# EAGLE design DMGC-PWR-01_2-0 (EAGLE 9.6.2)
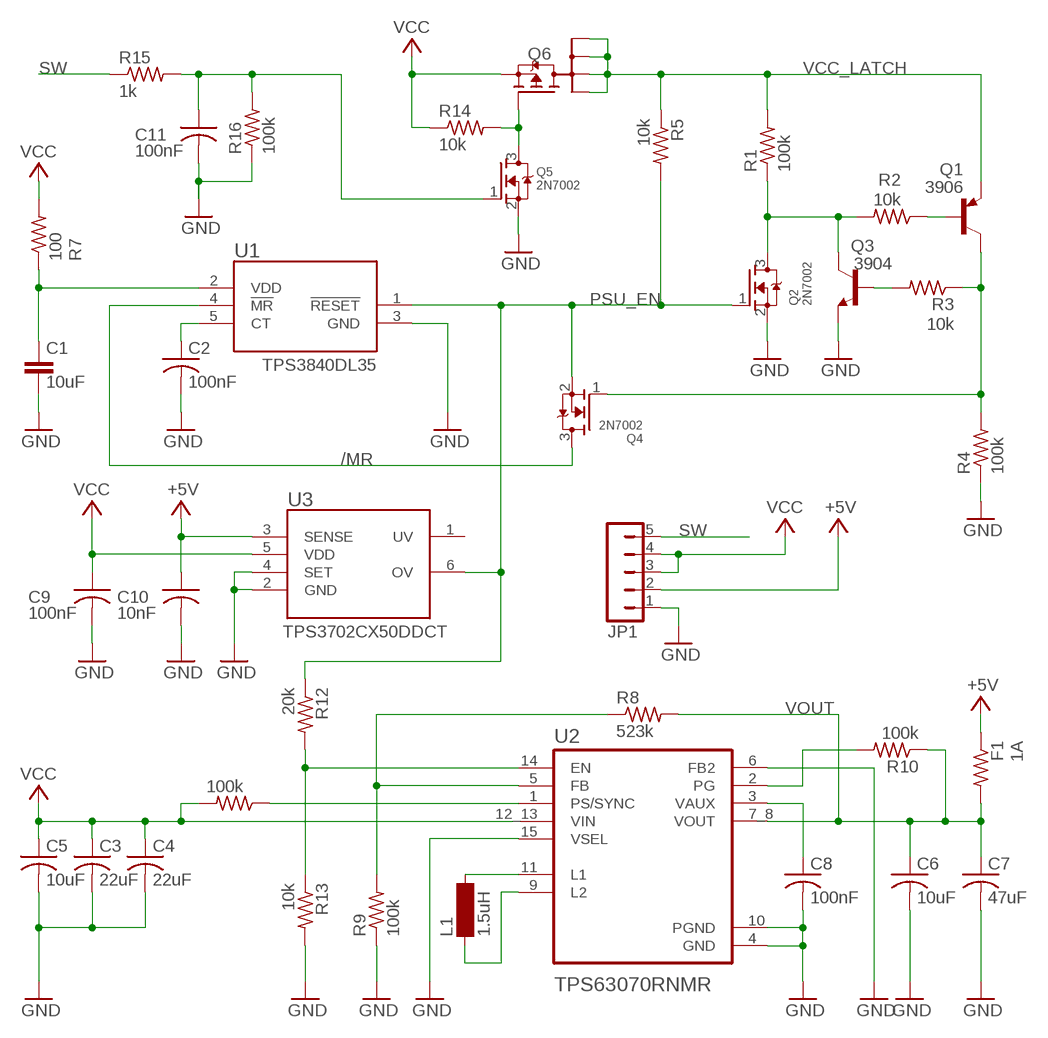
[diagram p0: schematic, sheet 1]

## Parts
C1  10uF  C-EUC0603  [C0603]
C2  100nF  C-USC0603  [C0603]
C3  22uF  C-USC1206  [C1206]
C4  22uF  C-USC1206  [C1206]
C5  10uF  C-USC0603  [C0603]
C6  10uF  C-USC0603  [C0603]
C7  47uF  C-USC1206  [C1206]
C8  100nF  C-USC0603  [C0603]
C9  100nF  C-USC0603  [C0603]
C10  10nF  C-USC0603  [C0603]
C11  100nF  C-USC0603  [C0603]
F1  1A  R-US_R0603  [R0603]
JP1  JP5  [JP5]
L1  1.5uH  LQH3NPN2R2  [1212]
Q1  MMBT3906LT1SMD  [SOT23-BEC]
Q2  2N7002  MOSFET-NREFLOW  [SOT23]
Q3  3904  MMBT3904LT1-NPN-SOT23-BEC  [SOT23-BEC]
Q4  2N7002  MOSFET-NREFLOW  [SOT23]
Q5  2N7002  MOSFET-NREFLOW  [SOT23]
Q6  SI1401EDH  [SOT363_INFINEON]
R1  100k  R-US_R0603  [R0603]
R2  10k  R-US_R0603  [R0603]
R3  10k  R-US_R0603  [R0603]
R4  100k  R-US_R0603  [R0603]
R5  10k  R-US_R0603  [R0603]
R7  100  R-US_R0603  [R0603]
R8  523k  R-US_R0603  [R0603]
R9  100k  R-US_R0603  [R0603]
R10  100k  R-US_R0603  [R0603]
R11  100k  R-US_R0603  [R0603]
R12  20k  R-US_R0603  [R0603]
R13  10k  R-US_R0603  [R0603]
R14  10k  R-US_R0603  [R0603]
R15  1k  R-US_R0603  [R0603]
R16  100k  R-US_R0603  [R0603]
U1  TPS3840  [SOT-23-5]
U2  TPS63070RNMR  [VREG_TPS63070RNMR]
U3  TPS3702  [SOT-23-6]

## Nets
+5V: C10.1 F1.1 JP1.2 U3.3(SENSE)
/MR: Q4.3(D) U1.4(!MR)
EN: R12.2 R13.1 U2.14(EN)
GND: C1.2 C2.2 C3.2 C4.2 C5.2 C6.2 C7.2 C8.2 C9.2 C10.2 C11.2 JP1.1 Q2.2(S) Q3.E Q5.2(S) R4.1 R9.1 R13.2 R16.1 U1.3(GND) U2.4(GND) U2.6(FB2) U2.10(PGND) U2.15(VSEL) U3.2(GND) U3.4(SET)
N$1: C1.1 R7.1 U1.2(VDD)
N$2: L1.2 U2.11(L1)
N$3: L1.1 U2.9(L2)
N$4: R10.2 U2.2(PG)
N$5: C8.1 U2.3(VAUX)
N$6: C2.1 U1.5(CT)
N$7: R8.1 R9.2 U2.5(FB)
N$8: Q5.3(D) Q6.3(G) R14.2
N$9: C11.1 Q5.1(G) R15.2 R16.2
N$10: Q1.B R2.1
N$12: Q1.C Q4.1(G) R3.1 R4.2
N$13: Q3.B R3.2
N$14: Q2.3(D) Q3.C R1.1 R2.2
PS: R11.1 U2.1(PS/SYNC)
PSU_EN: Q2.1(G) Q4.2(S) R5.2 R12.1 U1.1(!RESET) U3.6(OV)
SW: JP1.5 R15.1
VCC: C3.1 C4.1 C5.1 C9.1 JP1.3 JP1.4 Q6.4(S) R7.2 R11.2 R14.1 U2.12_13(VIN) U3.5(VDD)
VCC_LATCH: Q1.E Q6.1(D1) Q6.2(D2) Q6.5(D5) Q6.6(D6) R1.2 R5.1
VOUT: C6.1 C7.1 F1.2 R8.2 R10.1 U2.7_8(VOUT)
Unconnected: U3.1(UV)

## Notes on the sheet
- 3906
- TPS3840DL35
- TPS3702CX50DDCT

## Library data of the parts
C1 = rcl:C-EU: CAPACITOR, European symbol; SPICEPREFIX: C
C2-C11 = rcl:C-US: CAPACITOR, American symbol; SPICEPREFIX: C
F1 R1-R5 R7-R16 = rcl:R-US_: RESISTOR, American symbol; SPICEPREFIX: R
JP1 = jumper:JP5: JUMPER
L1 = gameboy:LQH3NPN2R2: INDUCTOR SMD power inductor; OC_FARNELL: unknown; OC_NEWARK: unknown
Q1 = transistor-pnp:MMBT3906*: PNP Transistror
Q2 Q4 Q5 = adafruit:MOSFET-N: N-Channel Mosfet 2N7002E - 60V 260mA SOT23 [Digikey: 2N7002ET1GOSTR-ND] - REEL BSH103 - 30V 850mA SOT23 [Digikey: 568-5013-1-ND]
Q3 = transistor-neu-to92:*-NPN-: NPN Transistror
Q6 = transistor-fet:SI1401EDH: OptiMOS(R)-P Small-Signal-Transistor Dual P-Channel, Enhancement mode, Super Logic Level (2.5 V rated) Source: http://www.infineon.com/upload/Document/BSD223P_Rev1.3.pdf
U1 = SOT95P280X145-5N:TPS3840
U2 = TPS63070RNMR:TPS63070RNMR: Check availability <https://pricing.snapeda.com/parts/TPS63070RNMR/Texas%20Instruments/view-part?ref=eda>; AVAILABILITY: In Stock; DESCRIPTION: Wide input voltage (2V-16V) buck-boost converter 15-VQFN-HR -40 to 125; MF: Texas Instruments; MP: TPS63070RNMR; PACKAGE: VQFN-HR-15 Texas Instruments; PRICE: None; PURCHASE-URL: https://pricing.snapeda.com/search/part/TPS63070RNMR/?ref=eda
U3 = SOT95P280X145-5N:TPS3702

## Board
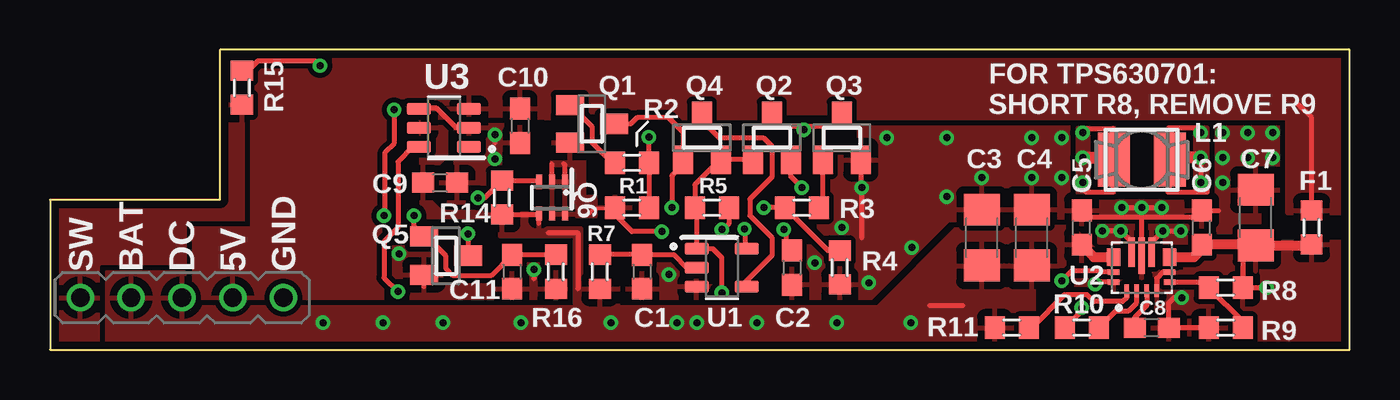
[diagram p1: board, top side]
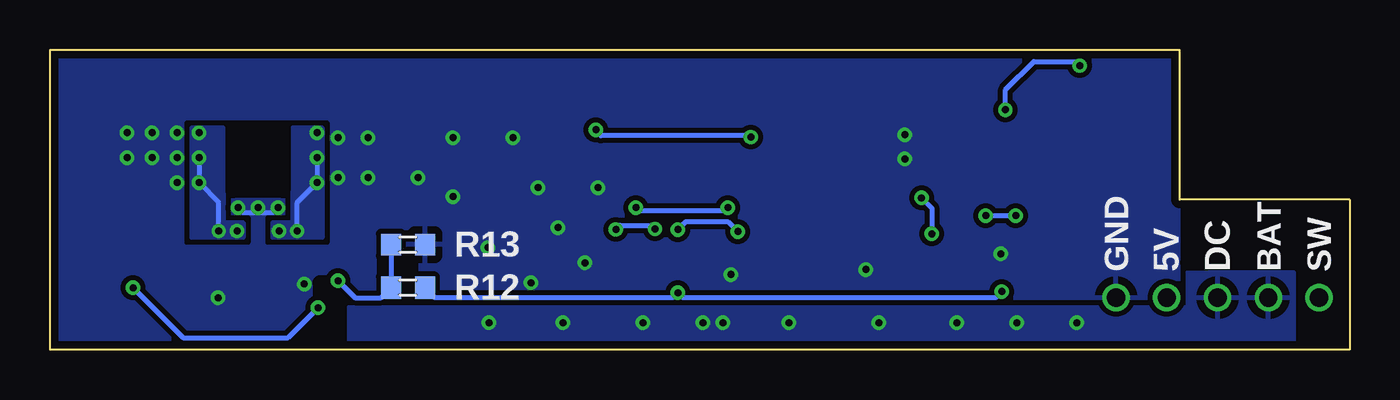
[diagram p2: board, bottom side, seen from below]

Size 65 x 15 mm. Coordinates in mm from the lower left corner, seen from the top.
Outline: 0,0 65,0 65,15 8.5,15 8.5,7.5 0,7.5 0,0
Copper layers (1*16): Top 0.0356mm / dielectric 1.5011mm / Bottom 0.0356mm
Design rules "jlcpcb *": minimum track width 7mil, minimum drill 13mil, track to track 7mil, track to pad 7mil, pad to pad 7mil, via to via 7mil, smd to smd 5mil, copper to edge 15mil, drill to drill 22mil, minimum pad ring 7mil, minimum via ring 7mil, stop-mask expansion 2.5mil, vias tented up to drill 14mil, thermal gap 15mil
tKeepout: area 42.1,-0.9 to 44.9,25.1; area 14.1,-3.9 to 16.9,20.1
tRestrict: area 53.9,7.9 to 55.4,8.3; area 61,6.1 to 61.1,7.3; area 28.9,7.8 to 29.1,8.8; area 36.1,7.1 to 40,11.3; area 52.4,2.6 to 52.6,3.6; area 36.4,2.9 to 36.6,3.6; area 49.7,2.1 to 50.8,3.7; area 25.5,10.8 to 26.4,11.1; area 24.1,10 to 24.7,11.1; area 17.1,5.6 to 18,5.9; area 23,9.3 to 24.2,9.6
bRestrict: area 53.4,7.9 to 55.9,11.1; area 51.4,2.4 to 51.5,3.4; area 7.1,4.3 to 8.1,8.1; area 47,3.6 to 48.3,4.6

### Footprints (pad centres in the part's own frame; a part is rotated, then mirrored left to right if it is on the bottom)
C0603 = smd 1.1 x 1: 1 -0.85,0; 2 0.85,0
C1206 = smd 1.6 x 1.8: 1 -1.4,0; 2 1.4,0
R0603 = smd 1 x 1.1: 1 -0.85,0; 2 0.85,0
JP5 = drill 0.914: 1 -5.08,0; 2 -2.54,0; 3 0,0; 4 2.54,0; 5 5.08,0
1212 = smd 1.6 x 2.7: 1 1.4,0; 2 -1.4,0
SOT23-BEC = smd 1 x 1.4: B -0.95,-1.1; C 0,1.1; E 0.95,-1.1
SOT23 = smd 1 x 1.4: 1 -0.95,-1.1; 2 0.95,-1.1; 3 0,1.1
SOT363_INFINEON = smd 0.3 x 0.7: 1 -0.65,-0.8; 2 0,-0.8; 3 0.65,-0.8; 4 0.65,0.8; 5 0,0.8; 6 -0.65,0.8
SOT-23-5 = smd 1.21 x 0.59: 1 -1.255,0.95; 2 -1.255,0; 3 -1.255,-0.95; 4 1.255,-0.95; 5 1.255,0.95
VREG_TPS63070RNMR = smd 0.6 x 0.25: 1 -1.15,0.75; 2 -1.15,0.25; 3 -1.15,-0.25; 4 -1.15,-0.75 | smd 0.25 x 0.6: 5 -0.725,-1.4; 6 -0.225,-1.4; 14 -0.225,1.4; 15 -0.725,1.4 | smd 0.85 x 0.7: 7_8 0.525,-1.4; 12_13 0.525,1.4 | smd 1.45 x 0.35: 9 0.775,-0.5; 11 0.775,0.5 | smd 1.8 x 0.35: 10 0.6,0
SOT-23-6 = smd 1.21 x 0.59: 1 -1.255,0.95; 2 -1.255,0; 3 -1.255,-0.95; 4 1.255,-0.95; 5 1.255,0; 6 1.255,0.95

### Placement (x,y rotation side)
C1  29.6,3.9 270 top
C2  37.1,4.1 270 top
C3  46.6,5.6 90 top
C4  49.1,5.6 90 top
C5  51.6,6.1 90 top
C6  57.6,6.1 90 top
C7  60.3,6.6 90 top
C8  55.1,1.1 0 top
C9  19.5,8.35 0 top
C10  23.5,11.2 270 top
C11  23.1,3.9 270 top
F1  63.1,6.1 270 top
JP1  6.6,2.6 180 top
L1  54.6,9.5 0 top
Q1  27.1,11.3 270 top
Q2  36.1,10.6 0 top
Q3  39.6,10.6 0 top
Q4  32.6,10.6 0 top
Q5  19.8,4.7 270 top
Q6  25.1,7.6 180 top
R1  29.1,7.1 180 top
R2  29.1,9.35 0 top
R3  37.6,7.1 0 top
R4  39.5,4.1 90 top
R5  33.1,7.1 180 top
R7  27.5,3.9 270 top
R8  58.8,3.1 0 top
R9  58.8,1.1 0 top
R10  51.6,1.1 0 top
R11  48.1,1.1 180 top
R12  47.1,3.1 180 bottom
R13  47.1,5.25 0 bottom
R14  22.6,7.6 90 top
R15  9.6,13.1 90 top
R16  25.3,3.9 90 top
U1  33.6,4.1 0 top
U2  54.6,4.1 90 top
U3  19.7,11.1 180 top

### Tracks (layer width: path | path; a pad name or v marks a point on that pad's centre or on a via)
+5V
  Top 0.25: F1.1 63.1,11.6 62.45,12.25
  pour Top (isolate 0.25, rank 4): 7.2,15.6 7.2,15.2 10.1,15.2 10.1,6.05 7.2,6.05 7.2,-0.15 17.14,-0.15 17.1,2 16.6,2.5 16.6,9.7 17.14,10.24 17.14,11.6 61.9,11.6 61.9,6.85 65.35,6.85 65.35,15.6
/MR
  Top 0.25: Q4.3 32.62,11.67 32.62,11.42 33.45,10.6 35.68,10.6 36.1,10.18 36.1,8.63 35,7.53 35,6.7 36.1,5.6 36.1,4.7 34.76,3.35 34.76,3.25 U1.4
EN  (via drill 0.35)
  Top 0.25: U2.14 52.61,3.88 52.55,3.93 51.08,3.93 v50.6,3.45
  Bottom 0.25: v50.6,3.45 49.75,2.6 48.45,2.6 R12.2 | R12.2 48.2,3.1 | R13.1 R12.2
GND  (via drill 0.35)
  Top 0.25: R9.1 C8.2 55.95,2.35 56.2,2.6 v56.6,2.6 | v52.28,3.28 52.38,3.38 U2.15 | U2.6 55.65,3.88 55.35,3.58 U2.4 | U2.10 54.6,6.6 | C5.2 51.95,6.6 54.6,6.6 | 54.6,6.6 57.25,6.6 C6.2 58.45,6.95 | v53.6,7.1 v55.6,7.1 | 59.6,8.1 60.2,8.1 C7.2 | 49.15,6.95 C4.2 | Q3.E 40.55,8.15 v40.6,8.1 40.6,5.6 | v37.6,8.1 37.05,8.65 Q2.2 | U3.4 18.5,12.1 19.3,12.1 20.3,11.1 U3.2 | C9.2 20.55,8.35 | 22.25,10.35 v22.25,10.75 | C11.2 23,2.95 | 18.7,3.15 Q5.2 | v24.2,4 24.2,3.55
  Bottom 0.25: v53.6,7.1 53.85,6.85 55.35,6.85 v55.6,7.1
  other vias: 30.95,3.75 54.6,7.1 40.95,3.35 41.85,10.6 50.6,10.6 49.1,10.6 49.1,8.6 44.85,7.65 50.6,8.6 46.6,8.6 58.65,10.85 61.15,10.85 61.15,9.6 58.65,9.6 58.65,8.35 59.9,9.6 59.9,10.85 44.85,10.6 43.1,5.1 38.25,4.35 39.6,6.1 17.45,4.8 22.25,9.55
  pour Top (isolate 0.25, rank 6): -0.4,18.35 68.6,18.35 68.6,-2.4 68.85,-2.65 68.85,-6.9 69.35,-7.4 -2.15,-7.4 -10.65,1.1 -10.65,8.1
  pour Bottom (isolate 0.25, rank 6): -2.4,17.1 -2.4,-1.65 -1.9,-2.15 67.1,-2.15 67.6,-1.65 67.6,16.35 66.1,17.85 -1.65,17.85
  pour Top (isolate 0.25): 20.8,9.5 23.9,9.5 23.9,11.2 20.8,11.2
  pour Top (isolate 0.25, rank 5): 17.8,4.5 19.8,4.5 19.8,4.1 20.2,3.7 22.2,3.7 22.8,4.3 26.1,4.3 26.1,2.2 17.4,2.2 17.4,4.1
N$1
  Top 0.25: R7.1 C1.1 31.2,4.75 31.85,4.1 U1.2
N$2  (via drill 0.35)
  Top 0.25: U2.11 54.1,5.39 v53.55,5.94 v52.63,5.94 | 51.9,7.9 51.55,8.25 v51.65,8.35 51.65,8.06 51.83,7.88 53.18,7.88 53.18,10.1 | v51.65,10.85 51.87,11.07 53.18,11.07 53.18,10.1 | 52.68,9.6 53.18,10.1
  Top 0.6: v51.65,9.6 52.68,9.6
  Bottom 0.25: v52.63,5.94 52.63,7.37 v51.65,8.35 v51.65,9.6
  pour Top (isolate 0.25, rank 3): 53.5,11.1 53.5,7.85 51.4,7.85 51.4,11.1
  pour Top (isolate 0.2, rank 3): 52.5,6.35 54.6,6.35 54.6,5.35 52.5,5.35
  pour Bottom (isolate 0.25, rank 2): 51.4,11.1 51.4,5.6 53.85,5.6 53.85,6.35 52.85,6.35 52.85,11.1
N$3  (via drill 0.35)
  Top 0.25: U2.9 55.1,5.39 v55.65,5.94 v56.57,5.94 | v57.55,9.6 v57.55,8.35 57.88,8.02 57.88,7.88 55.93,7.88 55.93,11.08 56.08,11.08 | v57.55,10.85 57.32,11.08 56.08,11.08 | 56.08,11.08 56.08,9.58 L1.1 56.1,9.6
  Top 0.6: v57.55,9.6 56.1,9.6
  Bottom 0.25: v56.57,5.94 56.57,7.37 v57.55,8.35 v57.55,9.6
  pour Top (isolate 0.25, rank 4): 55.7,11.1 55.7,7.85 57.9,7.85 57.9,11.1
  pour Top (isolate 0.2, rank 4): 55.05,6.35 56.85,6.35 56.85,5.35 55.05,5.35
  pour Bottom (isolate 0.25): 56.35,11.1 56.35,6.35 55.35,6.35 55.35,5.6 57.9,5.6 57.9,11.1
N$4
  Top 0.25: R10.2 53.3,1.95 53.95,1.95 54.35,2.35 U2.2
N$5
  Top 0.25: U2.3 54.85,2.21 54.25,1.61 C8.1
N$6  (via drill 0.35)
  Top 0.25: C2.1 36.8,5.25 36.8,5.92 v36.7,6.02 | v34.73,6.04 34.76,6.02 34.76,5.15 U1.5
  Bottom 0.25: v36.7,6.02 36.5,6.22 34.91,6.22 v34.73,6.04
N$7
  Top 0.25: U2.5 57.68,3.38 R8.1 59.65,1.4 R9.2
N$8  (via drill 0.35)
  Top 0.25: Q6.3 24.4,8.45 R14.2 21.75,7.6 v21.4,7.6 | v20.9,5.8 Q5.3
  Bottom 0.25: v21.4,7.6 20.9,7.1 v20.9,5.8
N$9  (via drill 0.35)
  Top 0.25: R16.2 C11.1 22.05,3.7 20.17,3.7 19.8,4.07 19.8,4.67 18.83,5.65 Q5.1 18.2,6.15 v18.2,6.7 | v16.7,6.7 16.77,6.77 16.77,9.88 17.24,10.35 17.24,11.97 v17.21,12 | v13.5,14.22 13.27,14.44 10.39,14.44 9.9,13.95 R15.2
  Bottom 0.25: v18.2,6.7 v16.7,6.7 | v17.21,12 17.21,13.01 15.8,14.42 13.5,14.42 v13.5,14.22
N$10
  Top 0.25: Q1.B 27.1,11.15 27.1,10.35 28.1,9.35 R2.1
N$12  (via drill 0.35)
  Top 0.25: v31.1,7.1 31.1,8.7 31.65,9.25 Q4.1 31.65,10.89 30.94,11.6 29.35,11.6 29.05,11.3 Q1.C | v35.7,7.1 R3.1 38.9,4.95 R4.2
  Bottom 0.25: v35.7,7.1 35.55,6.95 31.25,6.95 v31.1,7.1
N$13
  Top 0.25: R3.2 38.65,7.3 Q3.B
N$14  (via drill 0.35)
  Top 0.25: R1.1 R2.2 v29.95,10.64 | v37.7,11 37.7,11.15 | 37.7,11.15 36.35,11.15 36.1,11.4 Q2.3 | Q3.C 39.6,11.35 39.4,11.15 37.7,11.15
  Bottom 0.25: v29.95,10.64 30.01,10.7 37.45,10.7 37.7,10.95 v37.7,11
PS
  Top 0.25: U2.1 53.85,2.6 53.65,2.4 52.23,2.4 51.87,2.76 50.76,2.76 49.1,1.1 R11.1
PSU_EN  (via drill 0.35)
  Top 0.25: v33.6,2.85 33.6,4.6 33.15,5.05 U1.1 32.34,7 R5.2 32.25,8.25 33.52,9.53 Q4.2 Q2.1 | U3.6 18.15,10.15 17.4,9.4 17.4,6.1 16.7,5.4 16.7,3.6 v17.4,2.9
  Bottom 0.25: v17.4,2.9 17.7,2.6 33.35,2.6 v33.6,2.85 33.84,2.61 45.76,2.61 R12.1
SW
  pour Top (isolate 0.25, rank 5): 7.5,13 8.2,12.3 10.5,12.3 10.5,11.7 10.3,11.7 10.3,6.3 6.9,6.3 6.9,4.2 2.5,4.2 2.5,-0.4 -0.8,-0.4 -0.8,7.7 4.5,13
VCC  (via drill 0.35)
  Top 0.25: 45.65,2.2 44,2.2 | 18.65,8.65 C9.1 18.35,8.35 | R14.1 24.4,6.75 Q6.4 24.45,6.32 | 24.92,5.85 26.4,5.85 26.4,3.05
  Top 0.5: U2.12_13 52.2,4.62 51.6,5.22 C5.1
  other vias: 13.65,1.35 16.65,1.35 31.35,1.35 32.35,1.35 35.35,1.35 39.35,1.35 43.05,1.35 19.65,1.35 28.05,1.35 23.55,1.35
  pour Top (isolate 0.25, rank 3): 2.85,3.85 2.85,-0.9 47.1,-0.9 50.6,2.6 51.1,2.6 51.1,3.6 52.35,4.85 51.1,6.1 45.4,6.1 41.4,2.1 6.7,2.1 6.7,3.85
  pour Bottom (isolate 0.25): 2.8,-0.85 2.8,3.85 8.1,3.85 8.1,2.1 50.05,2.1 50.05,-0.85
  pour Top (isolate 0.25, rank 3): 22.5,6.8 22.5,6.85 19.55,6.85 19,7.4 19,8.9 19.8,9.7 19.8,11.5 18.55,11.5 18.55,6.65 22.5,6.65 22.5,5.7 26.25,5.7 26.25,0.9 28.3,0.9 28.4,1 28.4,3.2 26.55,3.2 26.55,6.05 24.85,6.05 24.5,6.4 24.5,6.8
VCC_LATCH  (via drill 0.35)
  Top 0.178: Q1.E 25.4,10.4 | 27.77,7.07 27.22,7.07 26.95,6.8
  Top 0.25: R5.1 33.95,6.3 33.65,6 v33.6,6 | v30.6,5.9 29.1,5.9 28.25,6.75 R1.2 | Q6.2 25.1,9.3 | Q6.1 25.75,9.25 25.7,9.3
  Bottom 0.25: v33.6,6 33.2,6.4 31.1,6.4 v30.6,5.9
  pour Top (isolate 0.25, rank 5): 25.1,11 25.1,6.7 29,6.7 29,7.6 26.7,7.6 26.7,11
VOUT  (via drill 0.35)
  Top 0.25: R10.1 51.6,1.95 v51.6,2.1 | v60.85,3.1 R8.2 59.65,4.55 C7.1
  Top 0.5: U2.7_8 57.23,4.62 57.6,5 C6.1 60.25,5.25 C7.1 63.05,5.2 F1.2
  Bottom 0.25: v51.6,2.1 53.1,0.6 58.35,0.6 v60.85,3.1
  pour Top (isolate 0.25, rank 4): 59.35,5.35 59.35,-0.4 65.35,-0.4 65.6,-0.15 65.6,5.35

### Text on the board
tPlace: FOR TPS630701: / SHORT R8, REMOVE R9 | Q6 | SW | BAT | DC | 5V | GND
bPlace: SW | BAT | DC | 5V | GND
bStop: DMGC-PWR-01 | v2.0